# EAGLE board proton (EAGLE 8.4.1)
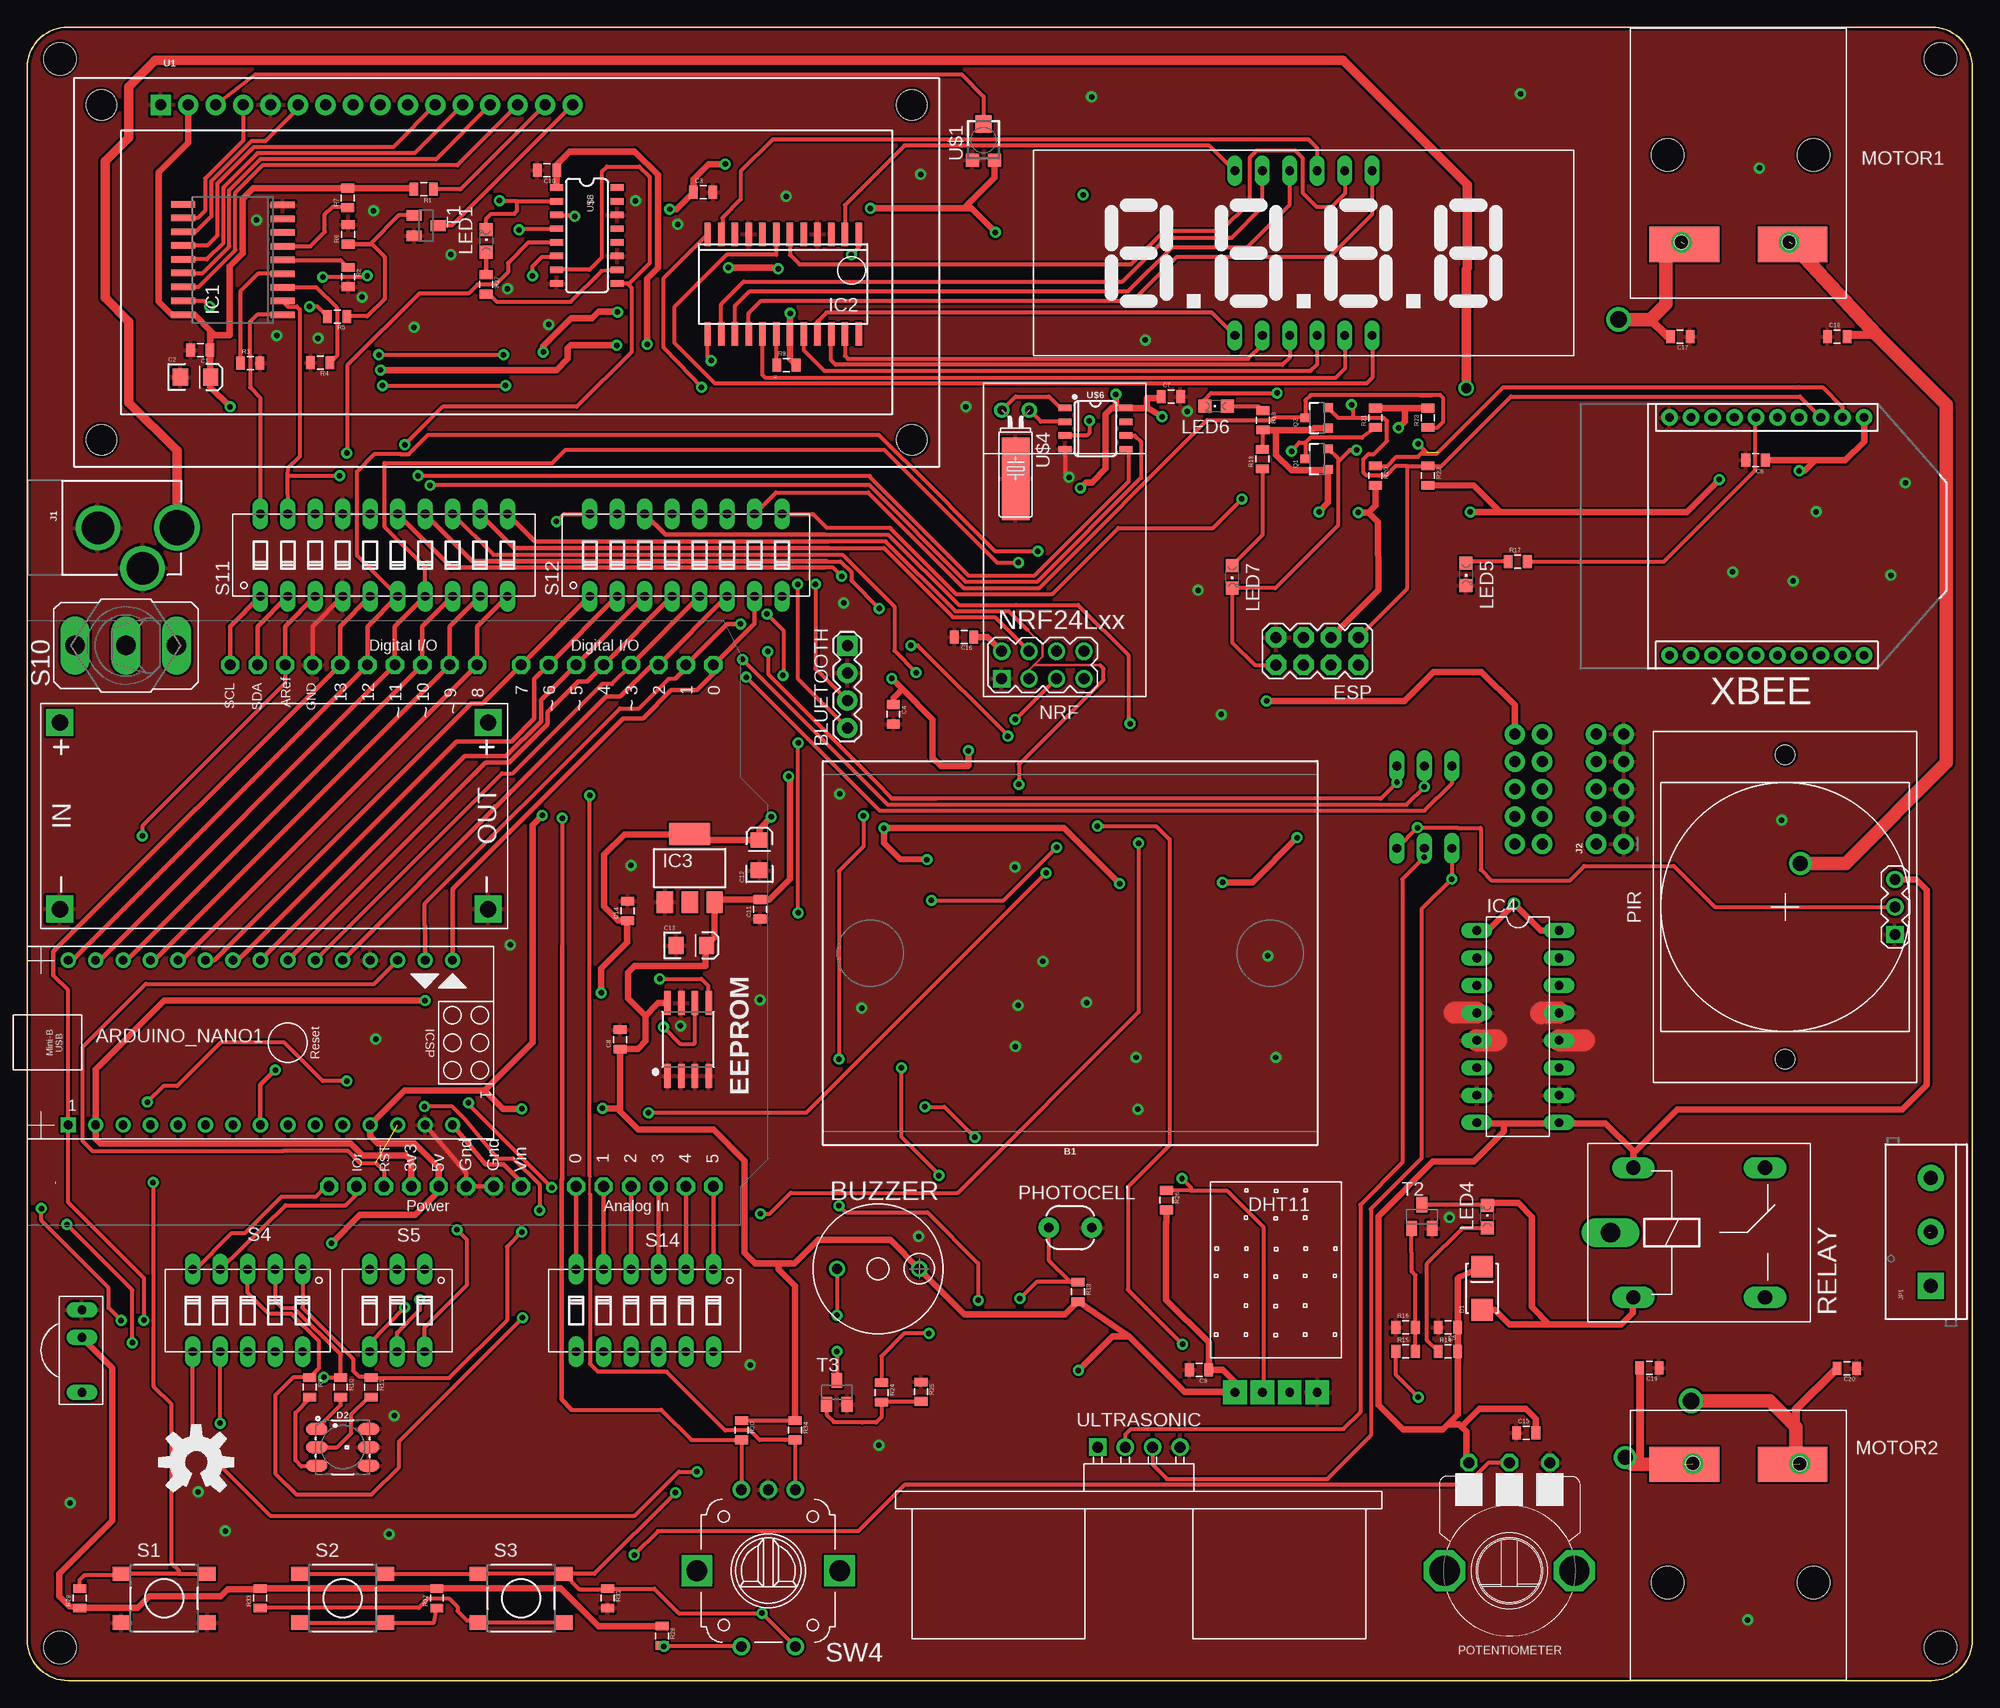
[diagram p2: board, top side]
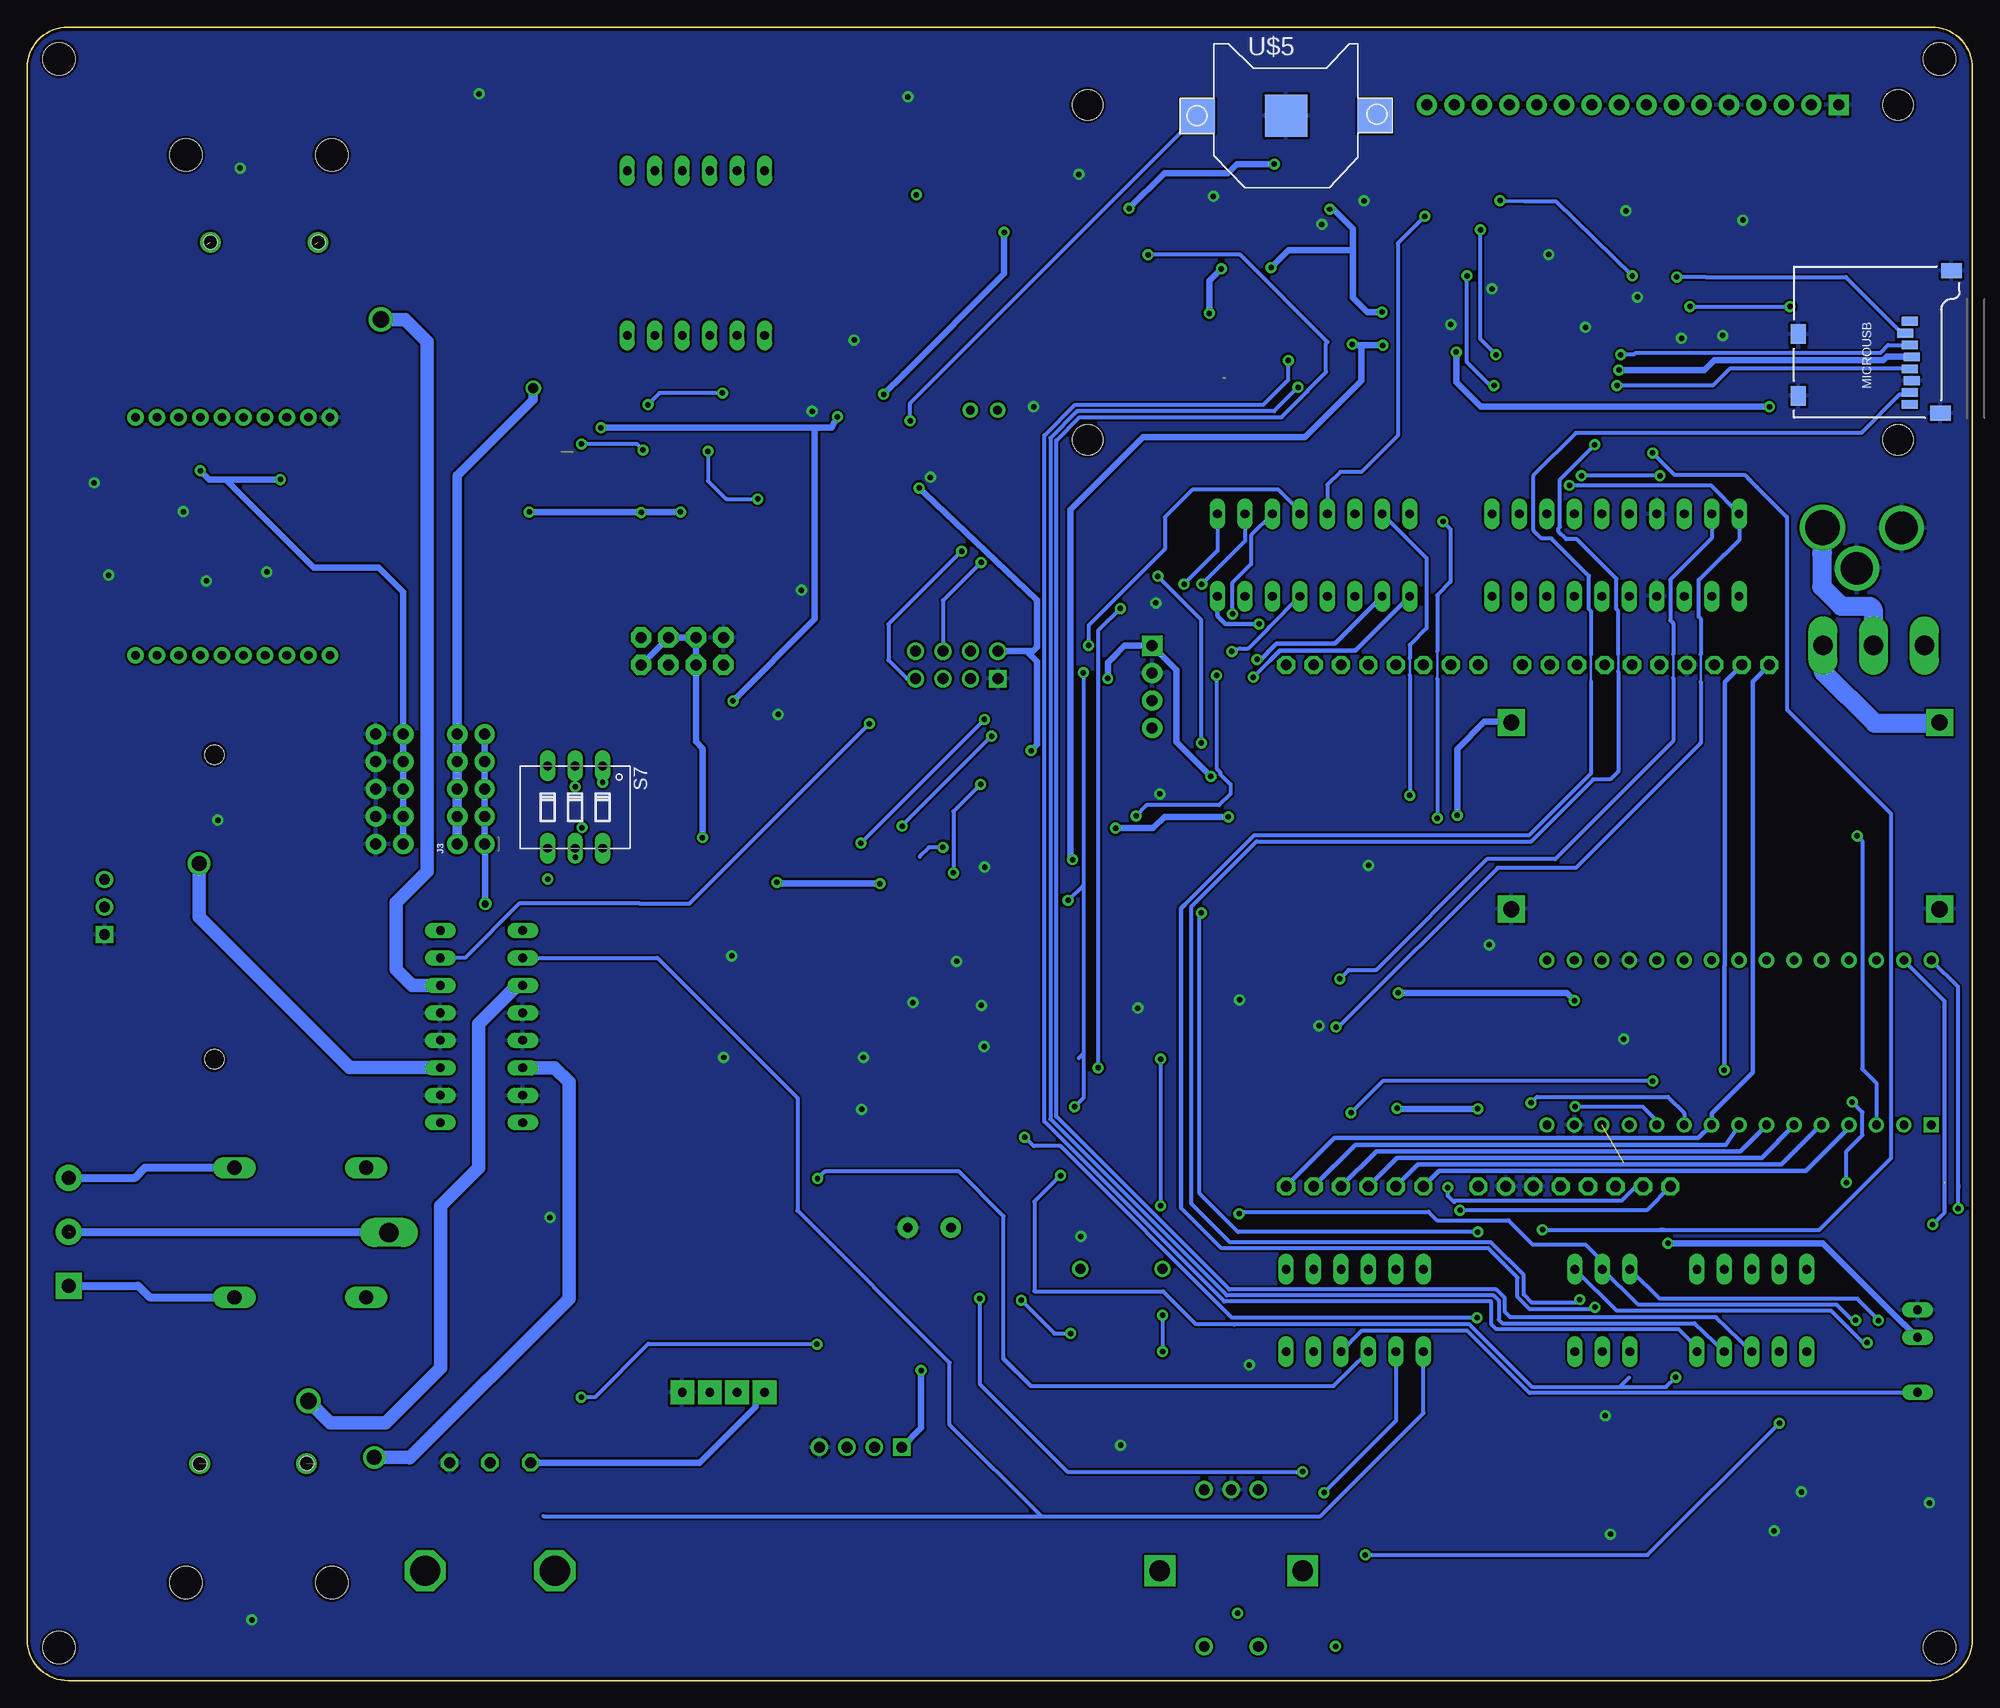
[diagram p3: board, bottom side, seen from below]

Size 180 x 153 mm. Coordinates in mm from the lower left corner, seen from the top.
Outline: 174,0 174.43,0
Outline: 0,149.19 0,3.81 arc90 3.81,0 176.19,0 arc90 180,3.81 180,149.19 arc90 176.19,153 3.81,153 arc90 0,149.19
Copper layers (1*16): Top 0.035mm / dielectric 1.5mm / Bottom 0.035mm
Design rules "tiny *": minimum track width 14mil, minimum drill 20mil, track to track 8mil, track to pad 12mil, pad to pad 8mil, via to via 8mil, smd to smd 8mil, copper to edge 10mil, drill to drill 8mil, minimum pad ring 12mil, minimum via ring 10mil, stop-mask expansion 4mil, vias tented up to drill 25mil, thermal gap 10mil
Holes 3 mm at 177.04,150.06 177.04,3.06 3.04,3.06 3.04,150.06 165.31,141.17 151.81,141.17 165.31,9.06 151.81,9.06
Holes 1.27 mm at 153.07,133.08 163.04,133.1 164.02,20.07 154.14,20.09

## Footprints (pad centres in the part's own frame; a part is rotated, then mirrored left to right if it is on the bottom)
ARDUINO_NANO = drill 0.8 square: 1 -20.32,-7.62 | drill 0.8: 2 -17.78,-7.62; 3 -15.24,-7.62; 4 -12.7,-7.62; 5 -10.16,-7.62; 6 -7.62,-7.62; 7 -5.08,-7.62; 8 -2.54,-7.62; 9 0,-7.62; 10 2.54,-7.62; 11 5.08,-7.62; 12 7.62,-7.62; 13 10.16,-7.62; 14 12.7,-7.62; 15 15.24,-7.62; 16 15.24,7.62; 17 12.7,7.62; 18 10.16,7.62; 19 7.62,7.62; 20 5.08,7.62; 21 2.54,7.62; 22 0,7.62; 23 -2.54,7.62; 24 -5.08,7.62; 25 -7.62,7.62; 26 -10.16,7.62; 27 -12.7,7.62; 28 -15.24,7.62; 29 -17.78,7.62; 30 -20.32,7.62
1X04 = drill 1.016 pad 1.88 square: 1 0,0 | drill 1.016 pad 1.88: 2 2.54,0; 3 5.08,0; 4 7.62,0
BMT1205XH7.5 = drill 0.9 pad 1.5: + 3.8,0; - -3.8,0
0805 = smd 0.8 x 1.2: 1 -0.9,0; 2 0.9,0
EIA3216 = smd 1.4 x 1.6: A 1.4,0; C -1.4,0
SMA-DIODE_ALT = smd 2 x 2: A -2,0; C 2,0
LED-TRICOLOR-5050 = smd 2 x 1.1: 1 -2.4,1.7; 2 -2.4,0; 3 -2.4,-1.7; 4 2.4,-1.7; 5 2.4,0; 6 2.4,1.7
SO08-EIAJ = smd 0.61 x 2.21: 1 -1.905,-3.378; 2 -0.635,-3.378; 3 0.635,-3.378; 4 1.905,-3.378; 5 1.905,3.353; 6 0.635,3.353; 7 -0.635,3.353; 8 -1.905,3.353
2X4 = drill 1.016 pad 1.88 octagon: 1 -3.81,-1.27; 2 -3.81,1.27; 3 -1.27,-1.27; 4 -1.27,1.27; 5 1.27,-1.27; 6 1.27,1.27; 7 3.81,-1.27; 8 3.81,1.27
SO18W = smd 0.6 x 2.2: 1 -4.445,-4.6; 2 -3.175,-4.6; 3 -1.905,-4.6; 4 -0.635,-4.6; 5 0.635,-4.6; 6 1.905,-4.6; 7 3.175,-4.6; 8 4.445,-4.6; 9 5.715,-4.6; 10 5.775,4.6; 11 4.505,4.6; 12 3.235,4.6; 13 1.965,4.6; 14 0.695,4.6; 15 -0.575,4.6; 16 -1.845,4.6; 17 -3.145,4.6; 18 -4.445,4.6
SO24W = smd 0.6 x 2.2: 1 -6.985,-4.6; 2 -5.715,-4.6; 3 -4.445,-4.6; 4 -3.175,-4.6; 5 -1.905,-4.6; 6 -0.635,-4.6; 7 0.635,-4.6; 8 1.905,-4.6; 9 3.175,-4.6; 10 4.445,-4.6; 11 5.715,-4.6; 12 6.985,-4.6; 13 6.985,4.6; 14 5.715,4.6; 15 4.445,4.6; 16 3.175,4.6; 17 1.905,4.6; 18 0.635,4.6; 19 -0.635,4.6; 20 -1.905,4.6; 21 -3.175,4.6; 22 -4.445,4.6; 23 -5.715,4.6; 24 -6.985,4.6
SOT223 = smd 1.5 x 2: 1 -2.3,-3.15; 2 0,-3.15; 3 2.3,-3.15 | smd 3.8 x 2: 4 0,3.15
DIL16 = drill 0.813 long: 1 -8.89,-3.81; 2 -6.35,-3.81; 3 -3.81,-3.81; 4 -1.27,-3.81; 5 1.27,-3.81; 6 3.81,-3.81; 7 6.35,-3.81; 8 8.89,-3.81; 9 8.89,3.81; 10 6.35,3.81; 11 3.81,3.81; 12 1.27,3.81; 13 -1.27,3.81; 14 -3.81,3.81; 15 -6.35,3.81; 16 -8.89,3.81
TSOP17XX = drill 0.813 long: GND -3.81,0; OUT 3.81,0; V+ -1.27,0
POWER_JACK_PTH_LOCK = drill 2.997 pad 4.115: GND 0.025,6.557; GNDBREAK 3.762,10.7 | drill 3.2 pad 4.115: PWR 0,13.878
2X5_NOSILK = drill 1.016 pad 1.88: 1 0,0; 2 0,2.54; 3 2.54,0; 4 2.54,2.54; 5 5.08,0; 6 5.08,2.54; 7 7.62,0; 8 7.62,2.54; 9 10.16,0; 10 10.16,2.54
SCREWTERMINAL-5MM-3 = drill 1.3 pad 2.413 square: 1 0,0 | drill 1.3 pad 2.413: 2 5,0; 3 10,0
CHIPLED_0805 = smd 1.2 x 1.2: A 0,-1.05; C 0,1.05
MICRO-SD-SOCKET-PP = smd 0.8 x 1.5: 1 -8.94,10.7; 2 -7.84,10.3; 3 -6.74,10.7; 4 -5.64,10.9; 5 -4.54,10.7; 6 -3.44,10.9; 7 -2.34,10.7; 8 -1.24,10.7 | smd 1.8 x 1.4: CD1 -2.05,0.4; CD2 -7.75,0.4 | smd 1.4 x 1.9: GND1 -13.6,14.55; GND3 -0.45,13.55
TOY_MOTOR = smd 3.251 x 6.452: P$1 5,15; P$2 5,5
WIRELESS-NRF24L01 = drill 1 square: 1 -12.7,6.35 | drill 1: 2 -10.16,6.35; 3 -12.7,3.81; 4 -10.16,3.81; 5 -12.7,1.27; 6 -10.16,1.27; 7 -12.7,-1.27; 8 -10.16,-1.27
PHOTOCELL-KIT = drill 0.9 pad 1.88: 1 -2,0; 2 2,0
MOTION-PIR-DYP-ME003 = drill 1 square: 1 -2.54,-10.16 | drill 1: 2 0,-10.16; 3 2.54,-10.16 | hole 1.8: -14.1,0; 14.1,0
P120PK = drill 1 octagon: A -3.75,-10; E 3.75,-10; S 0,-10 | drill 2.8 octagon: M1 -6,0; M2 6,0
SOT23-3 = smd 0.8 x 0.9: 1 -0.95,-1; 2 0.95,-1; 3 0,1.1
ZF112 = drill 1.321 long: 1 -6.096,5.994; 2 -6.096,-5.994; O 6.096,5.994; S 6.096,-5.994 | drill 1.803 long: P -8.204,0
DTSM-6 = smd 1.55 x 1.3: 1 -3.975,2.25; 2 3.975,2.25; 3 -3.975,-2.25; 4 3.975,-2.25
DIP05YL = drill 0.813 long: 1 -5.08,-3.81; 2 -2.54,-3.81; 3 0,-3.81; 4 2.54,-3.81; 5 5.08,-3.81; 6 5.08,3.81; 7 2.54,3.81; 8 0,3.81; 9 -2.54,3.81; 10 -5.08,3.81
DIP03YL = drill 0.813 long: 1 -2.54,-3.81; 2 0,-3.81; 3 2.54,-3.81; 4 2.54,3.81; 5 0,3.81; 6 -2.54,3.81
M9040P = drill 1.803 long: 1 0,4.699; 2 0,0; 3 0,-4.699
DIP10YL = drill 0.813 long: 1 -11.43,-3.81; 2 -8.89,-3.81; 3 -6.35,-3.81; 4 -3.81,-3.81; 5 -1.27,-3.81; 6 1.27,-3.81; 7 3.81,-3.81; 8 6.35,-3.81; 9 8.89,-3.81; 10 11.43,-3.81; 11 11.43,3.81; 12 8.89,3.81; 13 6.35,3.81; 14 3.81,3.81; 15 1.27,3.81; 16 -1.27,3.81; 17 -3.81,3.81; 18 -6.35,3.81; 19 -8.89,3.81; 20 -11.43,3.81
DIP08YL = drill 0.813 long: 1 -8.89,-3.81; 2 -6.35,-3.81; 3 -3.81,-3.81; 4 -1.27,-3.81; 5 1.27,-3.81; 6 3.81,-3.81; 7 6.35,-3.81; 8 8.89,-3.81; 9 8.89,3.81; 10 6.35,3.81; 11 3.81,3.81; 12 1.27,3.81; 13 -1.27,3.81; 14 -3.81,3.81; 15 -6.35,3.81; 16 -8.89,3.81
DIP06YL = drill 0.813 long: 1 -6.35,-3.81; 2 -3.81,-3.81; 3 -1.27,-3.81; 4 1.27,-3.81; 5 3.81,-3.81; 6 6.35,-3.81; 7 6.35,3.81; 8 3.81,3.81; 9 1.27,3.81; 10 -1.27,3.81; 11 -3.81,3.81; 12 -6.35,3.81
PEC12_INCREMENTAL_ENCODER = drill 1: A -2.5,-7.5; B 2.5,-7.5; C 0,-7.5; P1 -2.5,7; P2 2.5,7 | drill 1.9 square: GND@1 -6.6,0; GND@2 6.6,0
SOT23-BEC = smd 1 x 1.4: B -0.95,-1.1; C 0,1.1; E 0.95,-1.1
DHT11 = drill 0.8 pad 2.184 square: DATA -1.27,-11.43; GND 3.81,-11.43; NO 1.27,-11.43; VCC -3.81,-11.43
LCD-16X2 = drill 1.016 pad 1.88 square: 1 -32,15.5 | drill 1.016 pad 1.88: 2 -29.46,15.5; 3 -26.92,15.5; 4 -24.38,15.5; 5 -21.84,15.5; 6 -19.3,15.5; 7 -16.76,15.5; 8 -14.22,15.5; 9 -11.68,15.5; 10 -9.14,15.5; 11 -6.6,15.5; 12 -4.06,15.5; 13 -1.52,15.5; 14 1.02,15.5; 15 3.56,15.5; 16 6.1,15.5 | hole 2.8: -37.5,15.5; -37.5,-15.5; 37.5,15.5; 37.5,-15.5
TC33X = smd 1.2 x 1.2: 1 -1,-1.825; 3 1,-1.825 | smd 1.5 x 1.6: 2 0,1.5
MYLIB_LDQ_4D_7SEG = drill 0.8 long: 1 -6.35,-7.62; 2 -3.81,-7.62; 3 -1.27,-7.62; 4 1.27,-7.62; 5 3.81,-7.62; 6 6.35,-7.62; 7 6.35,7.62; 8 3.81,7.62; 9 1.27,7.62; 10 -1.27,7.62; 11 -3.81,7.62; 12 -6.35,7.62
TC38H_GNDPAD = drill 0.813: 1 -1.27,0; 2 1.27,0 | smd 2.54 x 7.62: P$1 0,6.35
CR1220-SMD = smd 3.2 x 3.2: +$1 -8.2,0; +$2 8.2,0 | smd 3.9 x 3.9: - 0,0
SO08-0.15 = smd 0.6 x 1.2: 1 -1.905,-2.8; 2 -0.635,-2.8; 3 0.635,-2.8; 4 1.905,-2.8; 5 1.905,2.8; 6 0.635,2.8; 7 -0.635,2.8; 8 -1.905,2.8
SO016 = smd 0.6 x 1.2: 1 -4.445,-2.8; 2 -3.175,-2.8; 3 -1.905,-2.8; 4 -0.635,-2.8; 5 0.635,-2.8; 6 1.905,-2.8; 7 3.175,-2.8; 8 4.445,-2.8; 9 4.445,2.8; 10 3.175,2.8; 11 1.905,2.8; 12 0.635,2.8; 13 -0.635,2.8; 14 -1.905,2.8; 15 -3.175,2.8; 16 -4.445,2.8
DC-DC-STEP-DOWN-LM2596 = drill 1.5 pad 2.5 square: IN+ -19.812,8.636; IN- -19.812,-8.636; OUT+ 19.812,8.636; OUT- 19.812,-8.636
UNO_R3 = drill 1 pad 1.676 octagon: 3V 35.56,2.54; 5V 38.1,2.54; A0 50.8,2.54; A1 53.34,2.54; A2 55.88,2.54; A3 58.42,2.54; A4 60.96,2.54; A5 63.5,2.54; AREF 23.876,50.8; D0 63.5,50.8; D1 60.96,50.8; D2 58.42,50.8; D3 55.88,50.8; D4 53.34,50.8; D5 50.8,50.8; D6 48.26,50.8; D7 45.72,50.8; D8 41.656,50.8; D9 39.116,50.8; D10 36.576,50.8; D11 34.036,50.8; D12 31.496,50.8; D13 28.956,50.8; GND 26.416,50.8; GND1 43.18,2.54; GND2 40.64,2.54; IOREF 30.48,2.54; RESERVED 27.94,2.54; RESET 33.02,2.54; SCL 18.796,50.8; SDA 21.336,50.8; VIN 45.72,2.54
ULTRASONIC-HC-SR04#V = drill 1 square: 1 -3.81,0 | drill 1: 2 -1.27,0; 3 1.27,0; 4 3.81,0
XBEE-SILK = drill 0.8 pad 1.524: 1 -11,20; 2 -11,18; 3 -11,16; 4 -11,14; 5 -11,12; 6 -11,10; 7 -11,8; 8 -11,6; 9 -11,4; 10 -11,2; 11 11,2; 12 11,4; 13 11,6; 14 11,8; 15 11,10; 16 11,12; 17 11,14; 18 11,16; 19 11,18; 20 11,20

## Placement (x,y rotation side)
ARDUINO_NANO1  [ARDUINO_NANO]  24.13,59.03 0 top
B1  BREADBOARDMINI  [BREADBOARD-MINI]  96.52,67.31 180 top
BLUETOOTH  [1X04]  75.9,95.76 270 top
BUZZER  BMT1205XH7.5  [BMT1205XH7.5]  78.74,38.1 0 top
C1  100nf  [0805]  16.04,123.1 180 top
C2  10uf  [EIA3216]  15.6,120.61 0 top
C3  100nf  [0805]  62.56,137.72 0 top
C4  100nF  [0805]  80.15,89.41 270 top
C5  100nF  [0805]  131.47,32.7 180 top
C6  100nF  [0805]  159.93,112.91 180 top
C7  100nF  [0805]  105.84,118.81 0 top
C8  100nF  [0805]  54.86,59.32 90 top
C9  100nF  [0805]  108.45,28.74 180 top
C10  100nF  [0805]  48.11,139.75 180 top
C11  100nF  [0805]  67.84,71.37 90 top
C12  10uF  [EIA3216]  67.77,76.38 90 top
C13  10uF  [EIA3216]  61.47,68.02 0 top
C14  100nF  [0805]  55.58,71.22 90 top
C15  100nF  [0805]  138.71,22.94 0 top
C16  100nf  [0805]  86.7,96.57 180 top
C17  .1ufF  [0805]  152.96,124.36 180 top
C18  .1ufF  [0805]  167.49,124.36 0 top
C19  .1ufF  [0805]  150.1,28.93 180 top
C20  .1ufF  [0805]  168.38,28.91 180 top
D1  1N4007  [SMA-DIODE_ALT]  134.62,36.3 90 top
D2  [LED-TRICOLOR-5050]  29.21,21.59 0 top
EEPROM  I2C EEPROM  [SO08-EIAJ]  61.16,59.33 0 top
ESP  [2X4]  119.38,95.25 180 top
IC1  MCP2300X/SO  [SO18W]  19.05,130.81 90 top
IC2  MAX7219CWG  [SO24W]  69.95,129.21 180 top
IC3  LD117AS33TR  [SOT223]  61.32,75.18 0 top
IC4  L293D  [DIL16]  137.95,60.52 270 top
IR  TSOP1730  [TSOP17XX]  5.08,30.48 270 top
J1  POWER_JACKPTH_LOCK  [POWER_JACK_PTH_LOCK]  0,106.68 270 top
J2  [2X5_NOSILK]  147.73,77.41 90 top
J3  [2X5_NOSILK]  137.66,77.41 90 bottom
JP1  [SCREWTERMINAL-5MM-3]  176.16,36.53 90 top
LED1  Yellow  [CHIPLED_0805]  42.49,133.21 0 top
LED4  Blue  [CHIPLED_0805]  135.1,42.94 0 top
LED5  Yellow  [CHIPLED_0805]  133.15,102.36 180 top
LED6  Blue  [CHIPLED_0805]  110.02,117.92 90 top
LED7  Red  [CHIPLED_0805]  111.51,102.13 180 top
MICROUSB  USD-SOCKETNEW  [MICRO-SD-SOCKET-PP]  16.51,116.84 270 bottom
MOTOR1  TOY_MOTOR  [TOY_MOTOR]  168.34,127.89 90 top
MOTOR2  TOY_MOTOR  [TOY_MOTOR]  148.34,25.02 270 top
NRF  WIRELESS-NRF24L01  [WIRELESS-NRF24L01]  96.52,105.41 90 top
PHOTOCELL  PHOTOCELLPTH-KIT  [PHOTOCELL-KIT]  96.52,41.91 0 top
PIR  MOTION-PIR-DYP-ME003  [MOTION-PIR-DYP-ME003]  162.67,71.58 90 top
POTENTIOMETER  P120PK  [P120PK]  137.16,10.16 180 top
Q1  BSS138  [SOT23-3]  119.38,113.03 90 top
Q2  BSS138  [SOT23-3]  119.38,116.84 90 top
R1  100R  [0805]  36.7,137.97 180 top
R2  10k  [0805]  29.69,129.87 270 top
R3  10k  [0805]  20.65,121.89 0 top
R4  10k  [0805]  27.13,121.95 180 top
R5  1k  [0805]  28.7,126.21 180 top
R6  10k  [0805]  29.69,133.81 90 top
R7  10k  [0805]  29.67,137.19 90 top
R8  30k  [0805]  70.26,121.72 0 top
R9  330  [0805]  26.15,27.15 270 top
R10  330  [0805]  29.02,27.15 270 top
R11  330  [0805]  31.83,27.15 270 top
R13  10k  [0805]  97.23,35.98 270 top
R14  1k  [0805]  131.47,30.45 0 top
R15  1k  [0805]  127.56,30.45 0 top
R16  10k  [0805]  127.56,32.7 0 top
R17  1K  [0805]  137.92,103.53 0 top
R18  1K  [0805]  114.3,113.03 90 top
R19  1K  [0805]  114.35,116.61 270 top
R20  10K  [0805]  124.74,111.49 270 top
R21  10K  [0805]  124.74,116.84 90 top
R22  10K  [0805]  129.63,111.49 270 top
R23  10K  [0805]  129.63,116.84 90 top
R24  1k  [0805]  79.06,26.67 270 top
R25  10k  [0805]  82.7,26.73 270 top
R26  1k  [0805]  105.41,44.45 270 top
R27  1k  [0805]  42.47,129.18 270 top
R28  10k  [0805]  58.75,4.14 270 top
R29  10k  [0805]  4.88,7.62 90 top
R30  1k  [0805]  66.09,23.17 270 top
R31  1k  [0805]  53.7,7.62 270 top
R32  1k  [0805]  37.92,7.62 90 top
R33  3.9k  [0805]  21.59,7.62 90 top
R34  1k  [0805]  71.06,23.17 270 top
RELAY  ZF112  [ZF112]  154.72,41.46 0 top
S1  DTSM-6  [DTSM-6]  12.7,7.62 0 top
S2  DTSM-6  [DTSM-6]  29.21,7.62 0 top
S3  DTSM-6  [DTSM-6]  45.72,7.62 0 top
S4  [DIP05YL]  20.41,34.25 180 top
S5  [DIP03YL]  34.24,34.25 180 top
S7  [DIP03YL]  129.29,80.82 180 bottom
S10  [M9040P]  9.14,95.77 90 top
S11  [DIP10YL]  33.02,104.14 0 top
S12  [DIP08YL]  60.96,104.14 0 top
S14  [DIP06YL]  57.15,34.25 180 top
SW4  ENCODER  [PEC12_INCREMENTAL_ENCODER]  68.58,10.16 180 top
T1  BC847  [SOT23-BEC]  36.93,134.62 270 top
T2  BC847  [SOT23-BEC]  129.06,42.94 0 top
T3  BC847  [SOT23-BEC]  74.93,26.67 0 top
TEMPERATURESENSOR  [DHT11]  115.57,38.1 0 top
U1  LCD-16X2SILK  [LCD-16X2]  44.37,130.29 0 top
U$1  10k  [TC33X]  88.49,142.52 0 top
U$2  MYLIB_LCQ_4D_7SEG  [MYLIB_LDQ_4D_7SEG]  118.11,132.08 0 top
U$4  CRYSTAL_GNDPAD  [TC38H_GNDPAD]  91.47,117.55 180 top
U$5  [CR1220-SMD]  63.5,144.78 0 bottom
U$6  DS1307Z  [SO08-0.15]  98.86,115.85 270 top
U$7  [OSHW-LOGO-L]  15.66,20.21 0 top
U$8  74HC4050  [SO016]  51.82,133.71 270 top
U$11  DC-DC-STEP-DOWN-LM2596  [DC-DC-STEP-DOWN-LM2596]  22.86,80.01 0 top
U$14  UNO_R3  [UNO_R3]  0,43.18 0 top
ULTRASONIC  ULTRASONIC-HC-SR04#V  [ULTRASONIC-HC-SR04#V]  102.87,21.59 0 top
XBEE  XBEE-1B2  [XBEE-SILK]  149.97,105.87 270 top

## Tracks (layer width: path | path; a pad name or v marks a point on that pad's centre or on a via)
3.3V  (via drill 0.51)
  Top 0.356: R18.2 114.35,113.98 R19.2
  Top 0.406: 169.97,114.59 169.97,114.63
  Top 0.61: ESP.3 125.02,100.89 125.01,107.19 124.12,108.08 | v119.53,108.13 120.38,108.98 Q1.1 120.31,112.01 116.97,112.01 115.57,113.41 115.57,115.71 | 124.12,108.08 v123.16,108.08 | 165.46,112.91 168.24,112.91 169.97,114.63 XBEE.1 | 165.46,112.91 C6.1 | v163.97,111.94 164.5,111.94 165.46,112.91 | R22.2 133.87,110.56 136.3,108.13 v133.53,108.13 153.57,108.13 v156.57,111.13 | v32.72,121.26 49,121.26 50.04,122.3 50.04,123.29 50.3,123.55 v54.56,123.55 | v57.38,123.65 57.38,129.72 58.38,130.72 58.38,139.32 56.23,141.47 50.21,141.47 49.02,140.28 C10.1 | Q2.1 119.08,115.89 118.9,115.71 115.57,115.71 | R19.2 115.57,115.71 | v68.86,79.91 67.77,78.82 C12.A 61.87,77.78 IC3.4 61.29,78.31 55.27,78.31 53.39,76.43 53.39,71.6 54.67,70.32 C14.1 55.52,70.27 55.52,68.3 53.14,65.91 v53.14,63.63 | v101.09,73.74 95.96,78.87 v79.27,78.87 79.27,77.51 80.76,76.02 v83.25,75.97 | v110.62,73.86 113.36,73.86 v117.5,78 | v36.83,62.92 12.7,62.92 6.35,56.57 ARDUINO_NANO1.2 6.35,50.14 6.77,49.72 29.95,49.72 31.06,48.6 35.09,48.6 35.56,48.13 U$14.3V | C10.1 U$8.1 | C10.1 | 124.8,110.53 R20.2 124.74,108.7 124.12,108.08
  Bottom 0.61: ESP.2 ESP.3 ESP.5 ESP.6 118.11,86.87 117.5,86.26 v117.5,78 | v119.53,108.13 123.11,108.13 | 123.11,108.13 v123.16,108.08 | 123.11,108.13 v133.53,108.13 | v156.57,111.13 161.62,111.13 | 161.62,111.13 163.15,111.13 v163.97,111.94 | MICROUSB.4 7.94,122.48 8.27,122.16 23.89,122.16 24.79,121.26 v32.72,121.26 | 56.54,123.55 v54.56,123.55 | v57.38,123.65 57.28,123.55 56.54,123.55 | v68.86,79.91 74.78,79.91 75.82,78.87 v79.27,78.87 | v101.09,73.74 110.49,73.74 v110.62,73.86 | 56.54,123.55 56.54,120.27 61.75,115.06 76.73,115.06 83.46,108.33 83.46,76.19 v83.25,75.97 | v36.83,62.92 37.54,63.63 v53.14,63.63 | 161.62,111.13 153.49,103 147.47,103 145.19,100.71 J2.10 J2.8 J2.6 J2.4 J2.2
+5V  (via drill 0.51, 0.51 pad 0.51, 0.64)
  Top 0.356: 58.5,62.69 58.45,62.74 58.2,62.5 | 111.79,26.7 TEMPERATURESENSOR.VCC | 102.78,117.78 102.76,117.75 | R30.1 R34.1
  Top 0.61: D1.C 132.48,37.32 132.37,37.22 C5.1 132.37,32.4 132.37,29.41 | 131.47,23.72 132.37,24.62 132.37,29.41 | 131.47,23.72 130.99,23.24 127.28,23.24 125.02,25.5 125.02,42.96 130.09,48.04 133.87,48.04 136.66,50.83 136.66,51.49 136.74,51.57 | R26.2 105.49,43.45 arc45 105.41,43.26 105.41,42.42 105.4,42.41 105.4,35.24 109.35,31.29 C9.1 110.66,28.74 111.76,27.64 TEMPERATURESENSOR.VCC 111.76,27.54 | 101.95,31.84 R13.2 96.04,33.88 86.76,33.88 BUZZER.+ 79.87,40.77 73.18,40.77 71.02,38.61 69.53,38.61 | 101.95,31.84 107.1,26.7 111.79,26.7 | 69.53,38.61 67.36,38.61 66.41,39.56 66.41,48.09 63.53,50.98 56.54,50.98 54.86,52.65 54.86,52.91 | 54.86,52.91 C8.1 54.9,58.46 56.52,58.46 57.23,59.17 57.23,61.52 | ARDUINO_NANO1.12 31.75,50.41 32.44,49.72 35.87,49.72 38.1,47.49 U$14.5V 38.1,45.26 35.92,43.08 30.79,43.08 v28.18,40.47 | 57.23,61.52 58.2,62.5 58.39,62.69 EEPROM.8 | R1.2 35.69,138.09 R7.2 20.93,138.09 19.96,137.12 19.96,132.08 18.75,130.86 18.75,124.51 17.35,124.51 16.95,124.9 | ARDUINO_NANO1.12 33.25,52.91 | v53.24,52.96 54.81,52.96 54.86,52.91 | v70.47,83.67 70.59,83.55 70.59,74.17 68.69,72.27 C11.2 63.86,72.27 IC3.3 63.62,68.77 C13.A 62.76,67.92 62.76,66.14 56.24,66.14 55.63,65.53 55.63,63.12 57.23,61.52 | 100.74,117.75 U$6.8 102.76,117.75 103.61,117.75 | 100.74,117.75 100.36,117.75 99.8,117.2 99.8,112.12 98.54,110.86 97.96,110.86 v97.45,110.35 | R8.2 70.59,122.29 IC2.19 70.59,126.39 v70.61,126.52 | v54.64,126.62 54.61,126.64 52.88,126.64 52.29,126.05 50.35,126.05 47.75,123.46 v47.75,122.94 | v64.59,140.31 63.07,140.31 61.66,138.9 C3.1 60.09,136.14 v59.47,136.14
  Top 0.61: v78.03,136.22 86.69,136.22 | 86.69,136.22 89.51,139.04 89.51,140.68 U$1.3 | 86.69,136.22 87.38,136.22 v89.59,134.01 | v100.74,119.02 100.74,117.75 | v64.9,130.73 69.39,130.73 v69.49,130.63 | v87.1,86.06 87.1,84.66 87.05,84.61 84.56,84.61 83.8,85.36 83.8,88.94 80.99,91.76 | IR.V+ 7.87,28.96 7.87,14.78 2.97,9.88 2.97,7.8 3.9,6.87 R29.1 10.25,6.72 11.33,7.8 17.93,7.8 18.59,8.45 21.52,8.45 R33.2 R32.2 49.39,8.52 52.87,5.04 R28.1 | 42.35,54.62 46.79,59.06 46.79,79.17 v47.68,80.06 | 103.61,117.75 103.73,117.75 v105.02,116.94 | v126.9,115.93 127.46,116.49 127.46,117.67 127.39,117.74 | 127.39,117.74 R23.2 | 127.39,117.74 R21.2 | PIR.3 174.8,74.12 175.77,73.15 175.77,55.12 173.48,52.83 152.69,52.83 148.62,48.77 | v97.28,28.7 100.42,31.84 101.95,31.84 | 148.62,48.77 148.62,48.99 146.04,51.57 141.71,51.57 | 148.62,48.77 RELAY.1 | 16.95,124.9 15.49,126.37 IC1.18 13.4,126.37 12.18,127.58 12.18,139.57 14.91,142.31 U1.2 | 131.47,23.72 132.49,23.72 132.72,23.49 | 132.72,23.49 133.16,23.05 133.16,20.41 POTENTIOMETER.E | 132.72,23.49 134.37,25.15 138.66,25.15 139.6,24.21 C15.2 | v18.8,117.86 16.95,119.7 16.95,120.65 | 16.95,120.65 16.95,123.12 | 16.95,123.12 16.95,124.9 | v114.69,90.65 127.46,90.65 130.13,93.33 134.58,93.33 137.66,90.25 J3.9 | ARDUINO_NANO1.12 34.96,54.62 42.35,54.62 | 42.35,54.62 44.06,52.91 v45.77,52.91 | C1.1 16.95,123.12 | C2.A 16.95,120.65 | R14.2 132.37,29.41 | 103.61,117.75 103.61,118.68 103.62,118.68 104.82,118.68 C7.1 | 80.99,91.76 v80.01,92.74 | C4.1 80.15,90.92 80.99,91.76 | C16.1 88.85,96.57 NRF.2 | 141.71,51.57 136.74,51.57 | 141.71,51.57 IC4.9 | 136.74,51.57 134.19,51.57 IC4.8
  Top 0.61: IC4.1 135.14,69.41 v137.6,71.87 140.07,69.41 IC4.16 | R34.1 71.06,36.54 69.53,38.06 69.53,38.61
  Bottom 0.61: TEMPERATURESENSOR.VCC 112.6,25.83 112.6,25.33 117.76,20.16 POTENTIOMETER.E | IR.V+ 6.3,32.97 6.34,32.97 13.84,40.47 v28.18,40.47 | v45.77,52.91 53.19,52.91 v53.24,52.96 | v70.47,83.67 73.64,86.83 73.64,93.5 BLUETOOTH.1 78.46,95.76 79.54,94.67 | 87.53,95.25 86.94,95.25 86.56,95.63 86.56,99.99 96.9,109.83 97.42,110.35 v97.45,110.35 | 87.53,95.25 NRF.2 | v54.64,126.62 55.98,126.62 57.33,127.97 57.33,132.33 | v64.59,140.31 68.05,140.31 68.87,139.49 74.76,139.49 v78.03,136.22 | v89.59,134.01 89.59,130.18 98.83,120.93 | 98.83,120.93 v100.74,119.02 | 57.33,132.33 63.3,132.33 v64.9,130.73 | v70.61,126.52 70.61,129.51 v69.49,130.63 | 87.53,95.25 86.56,94.28 86.56,86.59 v87.1,86.06 | 79.54,94.67 79.48,94.67 | v47.68,80.06 47.68,86.21 45.16,88.72 42.75,88.72 U$11.OUT+ | v105.02,116.94 105.56,115.93 107.15,115.93 | 107.15,115.93 v126.9,115.93 | 57.33,132.33 57.33,134.35 59.12,136.14 v59.47,136.14 | ULTRASONIC.1 97.28,23.37 v97.28,28.7 | v47.75,122.94 47.75,120.14 45.47,117.86 v18.8,117.86 | 107.15,115.93 107.15,98.2 v114.69,90.65 | 98.85,120.94 98.83,120.93 | J3.9 J3.7 J3.5 J3.3 J3.1 137.6,77.36 v137.6,71.87 | v80.01,92.74 80.01,94.21 79.54,94.67
+12V  (via drill 0.91)
  Top 0.889: J1.PWR 13.88,113.79 9.42,118.25 9.42,125.75 7.23,127.94 7.23,140.58 9.41,142.76 9.41,147.5 11.86,149.95 121.73,149.95 133.27,138.4 133.27,130.68 133.17,130.58 133.17,119.6 v133.16,119.58
  Bottom 0.889: v133.16,119.58 133.16,118.54 140.2,111.51 J3.10 J3.8 J3.6 J3.4 J3.2
  Bottom 1.778: J1.PWR 13.88,104.34 13.95,104.27 13.95,101.21 12.14,99.4 9.46,99.4 9.18,99.12 9.18,95.81 S10.2
-A0
  Top 0.406: S14.6 U$14.A0
  Bottom 0.406: U$14.A0 49.38,47.14 15.44,47.14 11.43,51.16 ARDUINO_NANO1.4
-A1
  Top 0.406: U$14.A1 S14.5
  Bottom 0.406: U$14.A1 51.31,47.75 17.68,47.75 14.02,51.41 ARDUINO_NANO1.5
-A2
  Top 0.406: U$14.A2 S14.4
  Bottom 0.406: U$14.A2 53.24,48.36 19.51,48.36 16.51,51.36 ARDUINO_NANO1.6
-A3
  Top 0.406: U$14.A3 S14.3
  Bottom 0.406: U$14.A3 55.17,48.97 21.49,48.97 ARDUINO_NANO1.7
-A6  (via drill 0.51)
  Top 0.356: S4.4 23.93,43.98 29.46,43.98 30.48,45 U$14.IOREF | v48.54,45.63 40.84,53.33 v40.84,53.45
  Bottom 0.356: U$14.IOREF 31.15,45.72 32.47,44.4 47.87,44.4 47.98,44.28 48.54,44.84 v48.54,45.63 | v40.84,53.45 40.28,54.01 28.17,54.01 26.67,52.51 ARDUINO_NANO1.10
-A7  (via drill 0.51)
  Top 0.356: U$14.RESERVED 27.65,45.72 26.7,44.77 23.53,44.77 20.17,41.4 18.95,41.4 15.47,37.92 S4.5 | v36.77,53.11 39.35,53.11 40.56,51.9 43.53,48.34 44.97,48.34 47.41,45.9 v47.41,43.51
  Bottom 0.356: U$14.RESERVED 30.15,43.51 v47.41,43.51 | v36.77,53.11 30.53,53.11 29.21,51.79 ARDUINO_NANO1.11
-AREF  (via drill 0.51)
  Top 0.356: U$14.AREF 23.9,93.95 23.9,92.3 10.67,79.07 v10.67,78.16
  Top 0.406: S11.3 23.88,97.54 U$14.AREF
  Bottom 0.356: v10.67,78.16 10.21,77.7 10.21,56.62 8.89,55.3 ARDUINO_NANO1.3
-D2
  Top 0.406: S12.6 U$14.D2 57.81,93.98 54.86,91.03 53.59,91.03 43.28,80.72 | ARDUINO_NANO1.20 43.28,80.72 | 43.28,80.72 43.28,80.87
-D3  (via drill 0.51)
  Top 0.356: 79.67,81.98 78.98,82.72 68.63,93.07 68.63,95.12 v68.53,95.22 | 79.67,81.98 80.01,81.61 125.25,81.61 v126.75,83.11 S7.1 | 79.67,81.98 80.03,81.62 80.24,81.61 84.1,81.61 | U$14.D3 54.1,92.2 53.21,92.2 44.95,83.93 43.96,83.93 ARDUINO_NANO1.21
  Top 0.406: S12.5 U$14.D3
  Bottom 0.356: v68.53,95.22 67.75,95.51 67.01,95.51 65.11,97.41 65.11,97.45 S12.5
-D4
  Top 0.406: S12.4 U$14.D4 51.82,92.46 51,92.46 48.16,89.61 48.16,88.5 44.6,84.94 42.42,84.94 ARDUINO_NANO1.22
-D5
  Top 0.406: S12.3 U$14.D5 47.55,90.73 47.55,88.75 44.35,85.55 40.49,85.55 ARDUINO_NANO1.23
-D6  (via drill 0.51)
  Top 0.356: v66.2,94.47 79.63,81.05 127.64,81.05 v129.29,82.7 S7.2
  Top 0.406: S12.2 U$14.D6 46.94,92.66 46.94,89 44.83,86.89 39.75,86.89 19.51,66.65 ARDUINO_NANO1.24
  Bottom 0.356: 66.12,94.21 66.2,94.3 v66.2,94.47
  Bottom 0.406: 66.12,94.21 64.39,95.94 59,95.94 S12.2
-D7  (via drill 0.51)
  Top 0.356: v66.54,92.85 78.89,80.49 129.31,80.49 131.88,83.06 v131.88,84.58 S7.3
  Top 0.406: S12.1 U$14.D7 42.14,90.4 41.09,90.4 17.34,66.65 ARDUINO_NANO1.25
  Bottom 0.356: 65.02,94.36 v66.54,92.85
  Bottom 0.406: S12.1 57.07,95.33 64.06,95.33 65.02,94.36
-D8
  Top 0.406: S11.10 41.66,97.54 U$14.D8 14.33,66.65 ARDUINO_NANO1.26
-D9
  Top 0.406: S11.9 39.12,97.54 U$14.D9 11.79,66.65 ARDUINO_NANO1.27
-D10
  Top 0.406: S11.8 36.58,97.54 U$14.D10 9.25,66.65 ARDUINO_NANO1.28
-D11  (via drill 0.51, 0.51 pad 0.51)  (1 unrouted)
  Top 0.356: v9.75,31.27 9.75,36.13 v3.68,42.2 | S11.7 36.83,103.01 33.1,106.74 33.1,112.64 | 33.07,112.66 33.1,112.64 | 33.1,112.64 48.58,112.64 49.82,113.88 79.3,113.88 | 79.3,113.88 79.78,113.4 | 79.3,113.88 89.73,103.45 v91.73,103.45
  Top 0.406: S11.7 34.04,97.54 U$14.D11 6.71,66.65 ARDUINO_NANO1.29
  Bottom 0.356: ARDUINO_NANO1.29 2.59,62.89 2.59,46 | S5.1 32.89,34.21 13.07,34.21 10.12,31.27 v9.75,31.27 | 2.59,46.16 2.59,43.29 v3.68,42.2 | v91.73,103.45 95.25,99.94 NRF.6
-D12  (via drill 0.51, 0.51 pad 0.51)
  Top 0.356: v8.71,33.31 7.56,34.47 7.56,36.32 1.32,42.56 v1.32,43.69 | S11.6 30.53,104.09 30.53,111.87 32.17,113.51 34.54,113.51 34.59,113.47 35.33,113.47 37.14,115.28 78.8,115.28 81.12,112.96 89.57,104.51 v93.52,104.51
  Top 0.406: S11.6 31.5,97.54 U$14.D12 4.17,66.65 ARDUINO_NANO1.30
  Bottom 0.356: ARDUINO_NANO1.30 1.32,64.16 1.32,45.9 | 1.32,45.9 1.32,45.53 | S5.3 28.93,35.33 10.65,35.33 8.71,33.39 v8.71,33.31 | v1.32,43.69 1.32,45.9 | v93.52,104.51 100.29,97.74 100.29,94.41 98.59,92.71 NRF.7
-D13  (via drill 0.51, 0.51 pad 0.51)
  Top 0.356: 2.44,65.25 3.81,63.88 ARDUINO_NANO1.1 3.8,51.4 3.8,44.25 10.8,37.25 v10.8,33.35 | NRF.5 91.47,88.93 v91.41,88.93 | v102.84,77.5 102.84,61.85 86.13,45.14 70.66,45.14 68.72,43.19 v67.86,43.19
  Top 0.406: S11.5 28.96,97.54 U$14.D13 2.44,67.46 2.44,65.25
  Bottom 0.356: v10.8,33.35 11.06,33.27 12.56,34.77 30.91,34.77 S5.2 34.24,38.79 35.81,40.36 40.7,40.36 42.94,42.6 49.56,42.6 50.33,43.37 67.68,43.37 v67.86,43.19 | v91.41,88.93 v102.84,77.5
-RX  (via drill 0.51)
  Top 0.356: 36.83,69.8 36.81,69.82 36.81,71.88 54.86,89.94 56.62,89.94 59.39,92.71 60,92.71
  Top 0.406: v66,97.78 64.76,97.78 U$14.D1 60.96,93.68 60,92.71 | ARDUINO_NANO1.17 36.83,69.8
  Bottom 0.406: v66,97.78 69.13,97.78 69.85,98.5 S12.8
-SCL
  Top 0.406: S11.1 18.8,97.54 U$14.SCL | U$14.A5 S14.1
  Bottom 0.406: U$14.A5 59.03,50.19 25.35,50.19 ARDUINO_NANO1.9 24.13,52.48 20.32,56.29 20.32,92.46 U$14.SCL
-SDA  (via drill 0.51)
  Top 0.406: S11.2 21.34,97.54 U$14.SDA | U$14.A4 S14.2 | v22.96,56.49 21.59,55.12 ARDUINO_NANO1.8
  Bottom 0.406: ARDUINO_NANO1.8 22.81,49.58 57.1,49.58 U$14.A4 | v22.96,56.49 22.96,66.1 22.92,66.15 22.92,92.4 U$14.SDA
-TX
  Top 0.406: S12.7 67.31,97.79 U$14.D0 63.5,93.17 61.98,91.64 59.61,91.64 57,89.03 55.17,89.03 39.37,73.23 ARDUINO_NANO1.16
_D3  (via drill 0.51)
  Top 0.356: PIR.2 156.17,71.58 152.37,75.38 144.09,75.38 142.76,74.05 135.48,74.05 134.49,75.04 134.49,78.89 132.35,78.89 132.32,78.92 v128.65,78.92 S7.6
_D6  (via drill 0.51)
  Top 0.356: ULTRASONIC.2 101.6,22.76 102.12,23.28 121.81,23.28 123.36,24.83 123.36,44.03 127.25,47.93 127.25,74.17 v129.29,76.2 S7.5
_D7  (via drill 0.51)
  Top 0.356: ULTRASONIC.3 104.14,19.99 105.46,18.67 120.32,18.67 124.33,22.68 124.33,43.64 129.03,48.34 129.03,71.37 v131.83,74.17 S7.4
A0
  Bottom 0.356: 132.22,15.21 86.16,15.21 | 86.16,15.21 60.33,15.21 50.8,24.74 S14.7 | 86.16,15.21 94.63,23.69 94.63,29.4 108.73,43.5 108.73,53.91 121.68,66.87 IC4.2
A1  (via drill 0.51)
  Top 0.356: S2.1 S2.2 S3.1 S3.2 | v60,17.39 52.48,9.87 S3.2 | S3.2 51.1,8.47 53.64,8.47 R31.1 53.85,8.51 58.04,8.51 60.3,6.25 v67.99,6.25 SW4.P1
  Bottom 0.356: S14.8 53.34,24.04 v60,17.39
A2  (via drill 0.51)
  Top 0.356: 107.67,45.35 R26.1 | 107.67,45.35 111.01,45.35 114.38,41.99 114.38,26.75 TEMPERATURESENSOR.DATA | v106.86,46.44 107.67,45.63 107.67,45.35
  Bottom 0.356: S14.9 59.11,27.25 87.1,27.25 89.64,29.79 | 87.15,27.25 89.64,29.74 89.64,29.79 | 89.64,29.79 89.64,42.96 93.76,47.09 106.21,47.09 v106.86,46.44
A3
  Bottom 0.356: S14.10 56.52,32.39 46.76,32.39 41,26.62 5.13,26.62 IR.OUT
A6  (via drill 0.51)
  Top 0.356: POTENTIOMETER.S 135.23,20.16 133.18,18.11 81.18,18.11 76.9,13.83 58.38,13.83 v56.17,11.62 | v17.87,23.81 S4.7
  Bottom 0.356: v56.17,11.62 30.06,11.62 v17.87,23.81
A7  (via drill 0.51)
  Top 0.356: PHOTOCELL.1 94.52,38.89 96.53,36.88 R13.1 93.39,36.88 v91.86,35.34 | S4.6 15.33,22.43 22.5,15.25 56.21,15.25 60.29,19.33 v61.98,19.33
  Bottom 0.356: v61.98,19.33 83.72,19.33 91.86,27.47 v91.86,35.34
D2  (via drill 0.51)
  Top 0.356: v68.45,98.69 70,97.14 70,92.96 | 70,92.72 70,92.96 | 70,92.96 v69.95,93.01 | v77.39,80.01 77.39,77.17 75.12,74.89 v75.12,57.51 | v75.13,43.92 75.72,43.33 83.3,43.33 88.01,38.62 v88.01,35.19 | R24.1 79.06,30.01 81.17,32.12 v83.45,32.12
  Bottom 0.356: S12.11 66.75,105.97 66.75,103.29 68.5,101.54 68.5,99.12 68.45,99.07 v68.45,98.69 | v69.95,93.01 69.95,84.4 69.58,84.04 69.58,83.86 68.64,82.92 68.64,82.05 69.7,81 76.4,81 v77.39,80.01 | v75.12,57.51 v75.12,43.93 v75.13,43.92 | v88.01,35.19 84.94,32.12 v83.45,32.12
D3  (via drill 0.51)
  Top 0.356: v90.75,87.38 90.75,87.43 82.4,95.78 v81.79,95.78 | v99.03,79.07 104.47,79.07 105.72,77.83 105.72,49.53 101.85,45.67 101.85,36.17 v106.91,31.12 | v128.73,26.21 126.66,28.28 R15.1
  Bottom 0.356: S12.12 62.23,108.2 64.21,110.19 72.19,110.19 74.73,107.65 74.73,104.7 81.79,97.64 v81.79,95.78 | v90.75,87.38 99.03,79.1 v99.03,79.07 | v106.91,31.12 122.4,31.12 122.48,31.19 127.46,26.21 v128.73,26.21
D4  (via drill 0.51)
  Top 0.356: U$8.3 50.55,135.61 v50.67,135.48
  Bottom 0.356: v50.67,135.48 53.16,132.99 53.16,115.21 56.54,111.84 58.5,111.84 59.69,110.64 S12.13
D5  (via drill 0.51)
  Top 0.356: 91.52,99.52 86.21,99.52 79.65,106.02 73.87,106.02 | 91.52,99.52 91.54,99.49 | 91.52,99.52 97.26,99.52 101.91,94.87 101.91,88.7 v102.06,88.54 | 73.48,106.02 73.41,106.02
  Top 0.406: S12.14 59.08,106.02 73.41,106.02 73.87,106.02
  Bottom 0.356: v102.06,88.54 117.31,73.29 118.72,71.88 123.29,71.88 134.46,71.88 139.47,66.87 IC4.15
D6  (via drill 0.51)
  Top 0.254: 52.1,45.01 52.07,45.03 52.07,46.66
  Top 0.356: 52.07,46.66 v52.07,81.92 | 52.1,45.01 52.1,29.33 52.85,28.58 59.18,28.58 64.6,23.15 66.89,23.15 67.78,22.26 70.15,22.26 R34.2 v71.06,17.68 SW4.A
  Bottom 0.254: 52.07,94.58 52.07,93.04
  Bottom 0.356: S12.15 50.52,103.86 50.52,97.38 52.07,95.83 52.07,94.58 | 52.07,93.04 v52.07,81.92
D7  (via drill 0.51)
  Top 0.356: 50.39,25.07 58.67,25.07 61.47,22.27 R30.2 v66.09,17.67 SW4.B | v49,107.24 49.71,107.95 S12.16 | v49.53,79.81 49.53,67.97
  Top 0.406: 49.53,67.97 49.53,46.35 49.45,46.28 49.45,26.01 50.39,25.07
  Bottom 0.254: 49.53,95.25 49.53,92.71
  Bottom 0.356: 49.53,95.25 49.53,100.43 48.29,101.68 48.29,106.53 v49,107.24 | 49.53,92.71 v49.53,79.81
D8  (via drill 0.51, 0.51 pad 0.51)
  Top 0.254: NRF.3 92.71,93.5 93.16,93.95 | 93.16,93.95 93.95,94.74 93.95,95.84 92.58,97.21 | 99.29,93.95 93.16,93.95
  Top 0.356: R29.2 4.88,9.32 5.33,9.78 8.63,9.78 S1.1 14.02,9.87 | 92.58,97.21 90.83,98.96 85.91,98.96 79.45,105.41 73.89,105.41 | 14.02,9.87 S1.2 | v91.77,82.93 91.77,84.76 99.6,92.59 99.6,93.63 99.29,93.95 | v94.29,74.73 72.09,52.53 v57.51,52.53 | v11.14,53.53 12.62,55.02 13.89,55.02 17.91,59.03 23.8,59.03 27.36,55.47 v29.59,55.47 | 14.02,9.87 14.02,10.19 13.38,10.83 13.38,25.55 11.74,27.2 11.74,46.01 v11.67,46.08
  Top 0.406: S11.11 46.99,105.41 73.89,105.41 74.12,105.41
  Bottom 0.356: v91.77,82.93 94.29,80.42 v94.29,74.73 | 55.3,54.74 v57.51,52.53 54.56,55.47 v29.59,55.47 | 11.11,53.53 v11.14,53.53 10.19,52.58 10.19,50.46 11.67,48.97 v11.67,46.08
D9
  Top 0.356: 74.17,104.8 79.27,104.8 85.67,98.4 89.56,98.4 NRF.4
  Top 0.406: 41.91,107.8 S11.12 45.06,104.8 74.17,104.8
D10  (via drill 0.51)
  Top 0.356: S4.3 20.41,35.88 22.34,33.95 24.46,33.95 27.03,31.38 27.03,28.92 R9.1 24.61,28.05 22.97,26.41 22.97,19.15 24.91,17.22 31.89,17.22 34.41,19.74 34.41,22.13 v45.85,33.57 | S11.13 43.16,104.17 75.44,104.17 80.25,99.35 80.25,95.29 v82.27,93.27 | v83.67,72.19 90.36,72.19 v95.26,77.09 | v83.08,53.1 84.87,53.1 v87.69,50.28
  Bottom 0.356: v95.26,77.09 96.56,77.09 97.41,76.24 | v82.27,93.27 82.27,73.58 | 82.27,73.58 v83.67,72.19 | 82.27,73.58 82.27,58.01 | 82.27,58.01 82.69,57.59 | 82.27,58.01 82.27,53.91 v83.08,53.1 | v45.85,33.57 68.5,33.57 84.39,49.46 86.87,49.46 v87.69,50.28
D11  (via drill 0.51)
  Top 0.356: 41.2,103.58 41.22,103.56 75.26,103.56 76.27,102.55 76.27,101.78 v78.84,99.21 | S4.2 22.95,35.15 23.6,34.51 24.69,34.51 29.02,30.18 29.02,28.12 | 29.02,28.12 R10.1 | v27.46,28.07 28.97,28.07 29.02,28.12 | v80.9,56.69 80.9,50.32 84.38,46.84 v84.38,46.74
  Top 0.406: S11.14 41.2,103.58 73.97,103.58
  Bottom 0.356: v78.84,99.21 80.9,97.15 v80.9,56.69 | 32.61,27.18 31.75,28.04 | 32.61,27.18 34.04,27.18 40.76,27.18 46.53,32.94 68.3,32.94 68.33,32.97 71.83,32.97 74.88,36.02 86.79,36.02 86.79,44.32 v84.38,46.74 | 32.61,27.18 28.35,27.18 v27.46,28.07
D12  (via drill 0.51)
  Top 0.356: v71.36,71.04 71.36,86.76 v71.35,86.77 | v75.38,102.18 74.59,102.97 73.33,102.97 | v45.77,41.5 44.42,40.15 44.42,33.34 39.08,28 31.85,28 R11.1 31.72,28.16 30.7,28.16 30.18,28.68 30.18,29.77 29.58,30.37 29.58,30.41 25.49,34.5 S4.1
  Top 0.406: S11.15 39.27,102.97 73.33,102.97 73.76,102.97
  Bottom 0.356: v45.77,41.5 67.95,41.5 71.5,45.06 71.5,70.9 v71.36,71.04 | v71.35,86.77 71.35,98.12 75.38,102.15 v75.38,102.18
DB4
  Top 0.356: IC1.13 16.67,132.78 17.6,133.71 17.6,138.51 20.98,141.88 33.87,141.88 U1.11
DB5
  Top 0.356: IC1.14 16.65,131.5 18.16,133.02 18.16,138.15 21.34,141.33 35.85,141.33 U1.12
DB6
  Top 0.356: IC1.15 16.27,130.24 18.72,132.69 18.72,137.92 21.57,140.77 37.83,140.77 U1.13
DB7
  Top 0.356: IC1.16 15.88,128.96 19.28,132.36 19.28,137.69 21.8,140.21 39.81,140.21 U1.14
DIN  (via drill 0.51)
  Top 0.356: XBEE.3 164.03,118.81 137.31,118.81 130.85,112.36 R22.1 127.71,112.36 | Q2.2 121.35,116.82 122.68,116.82 | 127.71,112.36 126.63,112.36 125.76,111.49 124.05,111.49 124.04,111.51 123.94,111.51 123.66,111.79 123.66,113.03 124.12,113.49 124.63,113.49 125.82,114.69 125.82,116.54 125.54,116.82 122.68,116.82 | ESP.1 127.71,101.04 127.71,112.36 | v115.65,119.13 109.56,119.13 108.97,118.53 LED6.C | v122.56,118.06 122.68,117.93 122.68,116.82
  Bottom 0.356: v115.65,119.13 121.49,119.13 v122.56,118.06
DOUT  (via drill 0.51)  (1 unrouted)
  Top 0.356: XBEE.2 167.97,117.84 166.15,119.67 163.93,119.67 163.91,119.68 163.74,119.67 136.58,119.67 130.9,113.98 130.58,113.66 130.45,113.53 128.99,113.53 | Q1.2 121.31,113.05 121.31,112.8 | 121.31,112.8 121.31,106.91 115.49,101.08 LED7.C 111.51,96.06 113.59,93.98 ESP.8 | 121.31,112.8 122.38,113.87 v123.01,113.87 | 129.24,113.89 129.47,113.66 | 129.24,113.89 v128.7,114.43 | R20.1 125.87,112.39 126.72,113.24 128.69,113.24 128.99,113.53 | 129.24,113.89 129.24,113.79 128.99,113.53
  Bottom 0.356: v123.01,113.87 123.57,114.43 v128.7,114.43
E
  Top 0.356: IC1.12 15.61,134.05 17.04,135.48 17.04,138.74 20.75,142.44 22.05,142.44 25.07,145.47 U1.6
GND  (via drill 0.51)
  Top 0.356: U$6.4 96.06,111.7 v96.42,111.34
  Top 0.406: S11.4 26.42,97.54 U$14.GND | ARDUINO_NANO1.14 40.64,46.99 U$14.GND2 U$14.GND1
  Top 2.032: IC4.4 132.09,61.79 | IC4.13 140.14,61.79 140.11,61.75 | IC4.5 135.69,59.25 135.7,59.23 135.92,59.23 135.93,59.25 | IC4.12 144.03,59.25 144.04,59.26
  other vias: 55.88,75.44 44.7,68.07 23.11,124.46 26.92,124.21 30.99,128.02 39.22,131.95 35.81,125.22 32.05,135.99 21.23,135.13 70.23,137.34 82.68,139.37 98.5,146.53 138.18,146.81 160.29,139.95 103.48,124.03 86.87,117.86 108.36,100.89 157.82,102.57 163.41,101.76 165.54,108.16 172.45,102.29 173.8,110.82 162.34,79.61 91.69,62.48 102.77,52.86 115.54,57.66 159.21,5.61 78.83,21.78 3.99,16.43 32.26,59.36 110.49,89.41 60.2,134.75 44.45,128.78 93.98,66.55 98.04,62.74 91.44,58.67 77.22,62.23 75.18,82.04 114.81,67.06 102.62,57.66 67.82,62.99 60.45,60.58 48.26,125.48 91.4,75.27 56.3,136.92 15.84,17.45 18.35,13.84 33.49,13.55 33.99,24.51 107.37,117.45 75.56,99.71 82.49,41.1 66.92,29.2 131.61,42.85
  pour Top: 0.09,153.21 180.02,153.21 180.07,153.15 180.07,-0.06 0.03,-0.06 0.01,-0.08 0.01,153.03 0.09,153.11
  pour Bottom: -0.01,153.21 180.07,153.21 180.07,-0.06 0.01,-0.06 0,-0.05
  pour Top: 88.91,106.55 93.08,106.55 94.21,107.68 94.21,111.57 94.98,112.34 95.11,112.47 98.89,112.47 99.09,112.66 99.09,119.13 98.7,119.51 88.95,119.51 87.97,118.53 87.97,107.42 88.82,106.57 88.91,106.57
LED
  Top 0.356: R27.2 42.76,128.28 43.47,127.57 50.3,127.57 53.16,130.42 U$8.10
LIGHT  (via drill 0.51)
  Top 0.356: R5.2 26.89,127.13 v26.14,127.13 | IC1.17 16.35,127.67 v16.89,127.13
  Bottom 0.356: v26.14,127.13 v16.89,127.13
MISO  (via drill 0.51 pad 0.51)
  Top 0.356: v34.94,34.54 31.7,31.19 S5.4
  Bottom 0.254: 35.31,94.95 35.31,92.43
  Bottom 0.356: MICROUSB.7 6.03,118.96 6.76,118.96 10.28,115.44 36.7,115.44 40.63,111.52 40.63,106.43 39.88,105.68 38.95,105.68 35.48,102.21 35.48,99.12 35.31,98.95 35.31,94.95 | 35.31,92.43 35.31,83.95 41.05,78.21 66.47,78.21 72.87,71.81 | 73.23,43.76 73.23,43.79 | 73.23,43.76 69.47,40 68.29,40 44.81,40 42.09,37.29 42.09,35.5 40.95,34.36 35.12,34.36 v34.94,34.54 | 73.23,71.22 73.23,43.76
  Bottom 0.406: 73.23,43.76 73.23,43.79 73.23,71.45 72.87,71.81
MOSI  (via drill 0.51, 0.51 pad 0.51)
  Top 0.356: U$8.5 46.41,133.07 44.5,131.17 44.5,130.3 43.37,129.17 41.67,129.17 40.85,128.35 36.3,128.35 29.64,121.69 29.64,113.64 v29.59,113.59 | S5.6 36.78,32.68 40.72,36.61 40.72,40.79 v39.79,41.72
  Bottom 0.356: v29.59,113.59 27.58,111.58 21.08,111.58 19.94,110.44 | 19.94,110.44 17.17,107.67 17.17,89.84 7.54,80.21 7.54,48.32 14.16,41.71 14.19,41.71 | 19.94,110.44 19.97,110.44 20.76,111.23 | 14.17,41.69 14.19,41.71 | 28.6,41.71 14.19,41.71 | 28.6,41.71 28.89,41.71 | v39.79,41.72 28.61,41.72 28.6,41.71
MOTOR1  (via drill 1.27, 1.52)  (1 unrouted)
  Top 0.762: C17.2 151.79,124.36 150.22,125.93
  Top 1.27: v147.27,125.93 150.22,125.93 151.64,127.36 151.64,131.73 MOTOR1.P$1
  Bottom 1.27: v147.27,125.93 145.03,125.93 143,123.9 143,74.84 145.83,72.01 145.83,65.81 144.35,64.33 IC4.14
  other vias: 153.07,133.08
MOTOR2  (via drill 1.27, 1.52)  (1 unrouted)
  Top 0.762: C20.2 163.65,25.08 163.65,21.54
  Top 1.27: MOTOR2.P$1 163.65,19.65 163.65,21.54 163.65,23.47 161.24,25.88 v153.98,25.88
  Bottom 0.508: 151.94,23.85 152.1,24
  Bottom 1.27: 151.94,23.85 146.81,23.85 141.73,28.93 141.73,43.93 138.2,47.46 138.2,60.77 134.64,64.33 IC4.3 | 152.1,24 v153.98,25.88
  other vias: 164.02,20.08
N$1  (via drill 1.27, 1.4)  (1 unrouted)
  Top 0.762: C19.2 149.2,20.47 149.66,20.02
  Top 1.27: MOTOR2.P$2 149.66,20.02 148.5,20.02 v147.87,20.65
  Bottom 1.27: IC4.6 131.19,56.71 129.86,55.37 129.86,35.33 144.58,20.61 144.62,20.65 v147.87,20.65
  other vias: 154.14,20.08
N$3
  Bottom 1.778: S10.3 13.84,93.37 9.06,88.58 3.11,88.58 U$11.IN+
N$4
  Top 0.356: 26.22,19.89 D2.3 26.75,19.82 25.38,19.82 24.84,20.36 24.84,24.79 26.15,26.1 R9.2
N$5
  Top 0.356: R32.1 37.66,5.37 S2.4 S2.3
N$6
  Top 0.356: 27.84,21.59 D2.2 28.7,21.59 30.01,22.9 30.01,24.64 31.6,26.23 R11.2
N$7
  Top 0.356: D2.1 29.02,25.5 R10.2
N$8
  Top 0.356: T3.B 73.98,24.6 74.65,23.93 77.22,23.93 77.27,23.88 78.56,23.88 79.06,24.37 R24.2 82.64,25.77 R25.2
N$9  (via drill 1.27, 1.4)  (1 unrouted)
  Top 0.762: C18.2 168.58,124.55 171.11,124.55
  Top 1.27: MOTOR1.P$2 171.11,124.55 177.6,118.06 177.6,84.92 168.28,75.6 v164.08,75.6
  Bottom 1.27: v164.08,75.6 164.08,70.68 150.15,56.74 141.8,56.74 IC4.11
  other vias: 163.04,133.08
N$11
  Top 0.356: S3.4 S3.3 41.56,5.56 40.7,5.56 39.84,6.42 39.84,6.82 39.05,7.6 37.12,7.6 36.24,6.72 R33.1
N$14
  Bottom 0.762: RELAY.O 169.09,47.45 170.01,46.53 JP1.3
N$18  (via drill 0.51)
  Top 0.356: BUZZER.- 74.94,33.82 | v74.93,30.45 T3.C
  Top 0.508: 74.94,33.82 v74.93,33.81
  Bottom 0.356: v74.93,33.81 v74.93,30.45
N$19
  Top 0.356: R14.1 129.54,31.49 129.54,38.58 132.85,41.89 LED4.A
N$20
  Top 0.356: 128.11,39.56 T2.B | 128.11,39.56 128.11,38.37 | R15.2 R16.2 128.46,37.5 128.12,37.85 128.12,39.55 128.11,39.56
N$21
  Top 0.356: 135.42,44.18 135.27,44.03 135.26,44.04 T2.C
  Top 0.61: 140.82,32.97 137.16,32.97 135.83,34.3 D1.A | LED4.C 135.42,44.18 137.96,44.18 139.23,42.91 139.23,34.56 140.82,32.97 | 140.82,32.97 147.52,32.97 148.59,34.04 148.59,35.49 RELAY.2
N$24  (1 unrouted)
  Bottom 0.762: RELAY.P 175.96,41.46
N$25
  Bottom 0.762: RELAY.S 168.66,35.46 169.72,36.53 JP1.1
N$29
  Top 0.356: IC1.5 29.02,131.44 R2.1
N$30
  Top 0.356: R3.1 19.74,121.91 19.74,128.55 21.36,130.18 IC1.4
N$31
  Top 0.356: R4.1 28.72,122.64 28.72,126.95 28.68,126.98 28.68,127.01 26.79,128.9 IC1.3
N$32  (via drill 0.51)
  Top 0.356: R28.2 58.85,3.24 v58.93,3.16 SW4.P2
N$33
  Top 0.356: T1.B 34.4,135.57 31.74,132.91 R6.1 31.91,132.91 33.07,131.75 33.07,127.84 31.47,126.24 29.81,126.24 R5.1
N$34
  Top 0.356: U1.3 21.12,148.63 86.45,148.63 88.51,146.57 U$1.2
N$35
  Top 0.356: U1.16 39.3,134.62 T1.C
N$36
  Top 0.356: U$6.2 93.8,116.48 U$4.1
N$37  (via drill 0.51)
  Top 0.356: U$6.3 98.07,115.21 98.3,115.44 v98.3,116.56
  Bottom 0.356: v98.3,116.56 98.3,118.18 U$5.+$1
N$38
  Top 0.356: IC2.14 64.24,127.36 66.32,129.44 101.35,129.44 105.44,133.53 111.48,133.53 114.33,136.37 114.33,139.67 U$2.11
N$39  (via drill 0.51)
  Top 0.356: v32.54,122.68 v44.09,122.68 | v45.52,134.24 45.62,134.34 U$8.4
  Bottom 0.356: v32.54,122.68 31.32,122.69 31.16,122.85 8.55,122.85 7.82,123.57 5.82,123.57 MICROUSB.3 | v44.09,122.68 45.52,124.1 v45.52,134.24
N$40  (via drill 0.51)
  Top 0.356: v32.89,119.84 v44.27,119.84 | v46.76,129.97 46.76,130.86 47.65,131.75 48.97,131.75 U$8.6
  Bottom 0.356: MICROUSB.5 22.46,121.38 24,119.84 v32.89,119.84 | v44.27,119.84 44.63,119.84 46.76,121.97 v46.76,129.97
N$41
  Top 0.356: U$6.1 95.61,117.75 94.54,118.82 91.47,118.82 U$4.2
N$42
  Top 0.356: 42.47,132.15 R27.1 42.47,132.13 LED1.A
N$43  (via drill 0.51)
  Top 0.356: 45.34,136.88 43.65,136.88 v43.71,136.94 | 45.34,136.88 U$8.2 | v31.47,129.97 31.35,129.85 27.32,129.85 v27.36,129.87 | LED1.C 42.49,135.27 42.95,135.72 45.07,135.72 45.34,135.99 45.34,136.88
  Bottom 0.356: MICROUSB.2 6.43,124.9 6.76,124.9 11.72,129.86 24.69,129.86 26.01,129.86 v27.35,129.86 v27.36,129.87 | v43.71,136.94 41.43,136.86 38.54,136.86 v31.47,129.97
N$46
  Top 0.356: R17.1 133.27,103.53 LED5.A
N$49
  Top 0.356: R18.1 114.3,105.98 LED7.A
N$50
  Top 0.356: LED6.A 113.94,117.92 R19.1
N$52
  Top 0.356: IC1.6 26.21,132.71 27.56,134.06 27.56,135.66 28.27,136.37 29.58,136.37 R7.1
N$53
  Top 0.356: R8.1 69.36,124.57 IC2.18
N$54
  Top 0.356: IC2.16 66.78,126.52 67.92,127.66 102.32,127.66 106.41,131.75 120.55,131.75 124.46,135.66 U$2.7
N$55
  Top 0.356: IC2.20 71.86,123.09 73.76,121.18 118.75,121.18 119.38,121.82 U$2.4
N$56
  Top 0.356: IC2.23 75.67,122.58 75.95,122.3 112.98,122.3 114.3,123.62 U$2.2
N$57
  Top 0.356: IC2.21 73.13,125.76 73.97,126.59 109.63,126.59 U$2.1
N$58
  Top 0.356: IC2.15 65.51,127.2 66.85,128.55 101.88,128.55 105.97,132.64 112.9,132.64 116.84,136.58 U$2.10
N$59  (1 unrouted)
  Top 0.356: 69.14,120.57 121.11,120.57 121.92,121.39 U$2.5 | IC2.17 68.05,120.8 68.28,120.57 69.34,120.57
N$60
  Top 0.356: U$2.3 116.84,122.43 116.15,121.74 74.83,121.74 74.4,122.17 IC2.22
N$61
  Top 0.356: IC2.7 69.32,131.95 69.34,131.93 64.72,131.93 59.92,127.13 59.92,123.75 63.65,120.01 123.93,120.01 124.46,120.55 U$2.6
N$62
  Top 0.356: IC2.6 70.59,131.93 71.48,131.04 102.16,131.04 105.2,134.09 110.44,134.09 113.11,136.76 113.11,140.9 113.81,141.59 117.33,141.59 118.03,140.9 118.03,137.65 119.3,136.37 120.73,136.37 121.97,137.62 121.97,139.65 U$2.8
N$63
  Top 0.356: U$2.9 119.38,141.81 118.59,142.6 68.99,142.6 66.04,139.65 66.04,137.05 64.34,135.36 64.34,133.92 IC2.11
N$64
  Top 0.356: U$2.12 111.71,139.7 109.4,142.01 86.46,142.01 86.44,142.04 81.18,142.04 75.67,136.53 IC2.2
N$65
  Top 0.356: U1.15 40.12,137.97 R1.1
N$71  (via drill 0.51)
  other vias: 97.71,137.46
RS
  Top 0.356: IC1.11 15.78,135.31 16.49,136.02 16.49,138.97 19.99,142.48 U1.4
RSSI
  Top 0.356: XBEE.6 159.91,116.81 159.91,112.01 151.43,103.53 R17.2
RST  (1 unrouted)
  Top 0.356: ARDUINO_NANO1.18 32.11,64.47 11,64.47 5.16,58.63 5.16,49.9 6.08,48.98 23.7,48.98 23.75,49.03 29.66,49.03 30.78,47.92 32.26,47.92 33.02,47.16 U$14.RESET
RX  (via drill 0.51)
  Top 0.356: 118.28,114.55 Q1.3 | 118.28,114.55 118.74,115.01 123.53,115.01 R21.1 | v72.95,101.45 72.95,93.62 BLUETOOTH.3 | S12.9 72.72,107.95 74.02,106.65 79.86,106.65 79.91,106.6 85.97,100.55 94.86,100.55 100.97,106.65 109.73,106.65 v112.4,109.32 | v116.99,113.74 117.72,114.55 118.28,114.55
  Bottom 0.356: S12.9 69.85,104.55 v72.95,101.45 | v112.4,109.32 115.32,109.32 116.99,111 v116.99,113.74
S_D10  (via drill 0.51)
  Top 0.356: v76.28,131.93 76.94,132.59 IC2.1
  Bottom 0.356: v76.28,131.93 67.74,131.93 59.68,123.86 59.8,123.74 59.8,121.07 61.52,119.35 61.52,119.29 63.92,116.89 82.62,116.89 84.76,114.75 84.76,52.2 68.76,36.2 44.06,36.2 43.27,35.4 43.27,34.12 42.77,33.63 23.74,33.63 S4.8
S_D11  (via drill 0.51)
  Top 0.356: v62.41,119.66 60.26,121.96 58.85,123.37 58.85,129.69 IC2.12
  Bottom 0.356: v62.41,119.66 64.62,117.45 82.85,117.45 85.32,114.98 85.32,51.97 68.99,35.64 44.3,35.64 43.83,35.17 43.83,33.4 43.5,33.07 25.72,33.07 S4.9
S_D12  (via drill 0.51)
  Top 0.356: v63.3,122.15 62.97,122.48 IC2.13
  Bottom 0.356: v63.3,122.15 63.3,120.37 65.61,118.06 83.03,118.06 85.88,115.21 85.88,51.74 69.22,35.08 44.53,35.08 44.53,32.97 44.07,32.51 27.19,32.51 25.49,30.81 S4.10
SCK  (via drill 0.51, 0.51 pad 0.51)
  Top 0.356: v34.96,114.36 38.46,117.86 50.85,117.86 55.93,122.94 55.93,128.88 55.55,129.26 | 55.55,129.26 U$8.9 | U$8.7 52.03,130.53 53.2,131.7 53.2,139.64 53.66,140.09 56.64,140.09 57.58,139.15 57.58,131.14 55.7,129.26 55.55,129.26 | S5.5 34.24,32.18 36.35,34.29 v36.35,35.25
  Bottom 0.254: 32.77,94.97 32.77,93.37
  Bottom 0.356: 32.77,94.97 32.77,98.95 32.94,99.12 32.94,101.94 36.61,105.61 37.59,105.61 38.3,106.32 38.3,106.62 38.18,106.74 38.18,111.14 v34.96,114.36 | 32.77,93.37 32.77,84.14 33.53,83.37 35.09,83.37 40.82,77.65 66.24,77.65 72.25,71.64 72.25,44.13 68.68,40.56 44.57,40.56 41.53,37.52 41.53,35.74 40.79,35 36.6,35 v36.35,35.25
SCL  (via drill 0.51)
  Top 0.356: IC1.1 21.29,126.37 20.63,125.7 20.63,122.7 20.63,122.69 20.63,119.66 21.59,118.7 S11.20 | U$6.6 102.48,115.21 103.07,114.62 103.07,111.31 93.43,101.66 86.89,101.66 77.91,110.64 37.34,110.64 v37.29,110.59 | v58.88,60.48 60.43,58.93 61.72,58.93 61.8,59 EEPROM.6
  Bottom 0.254: 25.15,94.95 25.15,92.43 25.17,92.41
  Bottom 0.356: 25.15,94.95 25.15,98.25 25.32,98.43 25.32,101.83 23.01,104.14 22.96,104.14 21.59,105.51 S11.20 24.23,110.59 v37.29,110.59 | 25.15,92.43 25.15,86.77 36.7,75.21 43.92,75.21 58.65,60.48 v58.88,60.48
SDA  (via drill 0.51)
  Top 0.356: IC1.2 24.14,127.15 24.95,127.15 25.23,126.86 25.23,113.27 | 25.23,113.27 25.25,113.26 | 24.08,111.48 24.13,112.17 25.23,113.27 | 24.08,111.48 S11.19 | v58.55,64.92 62.41,64.92 63.02,64.31 63.02,62.74 EEPROM.5 | v36.17,111.48 77.99,111.48 77.99,111.36 87.09,102.26 93.23,102.26 101.95,110.98 101.95,113.65 U$6.5 | 24.08,111.48 v28.91,111.48
  Bottom 0.254: 27.69,94.95 27.69,92.79
  Bottom 0.356: S11.19 24.13,105.69 27.97,101.85 27.97,98.12 27.69,97.84 27.69,94.95 | 27.69,92.79 27.69,86.92 38.6,76.01 44.92,76.01 55.16,65.77 57.7,65.77 v58.55,64.92 | v28.91,111.48 v36.17,111.48
TX  (via drill 0.51)
  Top 0.356: 128.74,118.95 130.01,118.95 | 128.74,118.95 118.77,118.95 118.28,118.46 Q2.3 115.36,116.84 115.15,116.63 109.19,116.63 93.66,101.1 86.65,101.1 77.83,109.93 69.29,109.93 S12.10 | v71.3,101.45 71.3,92.74 BLUETOOTH.4 | R23.1 130.49,115.94 131.03,116.47 131.03,118.66 130.73,118.95 128.74,118.95
  Bottom 0.356: S12.10 67.31,105.44 v71.3,101.45
VIN
  Top 0.406: ARDUINO_NANO1.15 42.42,47.75 44.09,47.75 45.72,46.13 U$14.VIN

## Text on the board
200bmp: IR